# EAGLE design musicbox mechanical-02 (EAGLE 9.6.2)
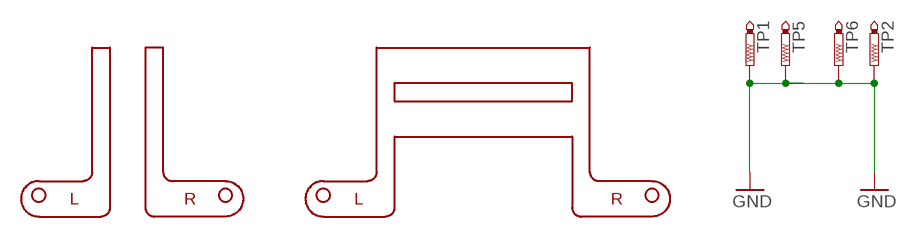
[diagram p0: schematic, sheet 1]

## Parts
TP1  PTR1B1,27  [B1,27]
TP2  PTR1B1,27  [B1,27]
TP5  PTR1B1,27  [B1,27]
TP6  PTR1B1,27  [B1,27]
U$1  LEFT-FOOT  [LEFT-FOOT]
U$3  RIGHT-FOOT  [RIGHT-FOOT]
U$5  TOP-PART  [TOP-PART]

## Nets
GND: TP1.TP TP2.TP TP5.TP TP6.TP

## Library data of the parts
TP1 TP2 TP5 TP6 = testpad:PTR1: TEST PIN
U$1 = music-box-parts:LEFT-FOOT
U$3 = music-box-parts:RIGHT-FOOT
U$5 = music-box-parts:TOP-PART

## Board
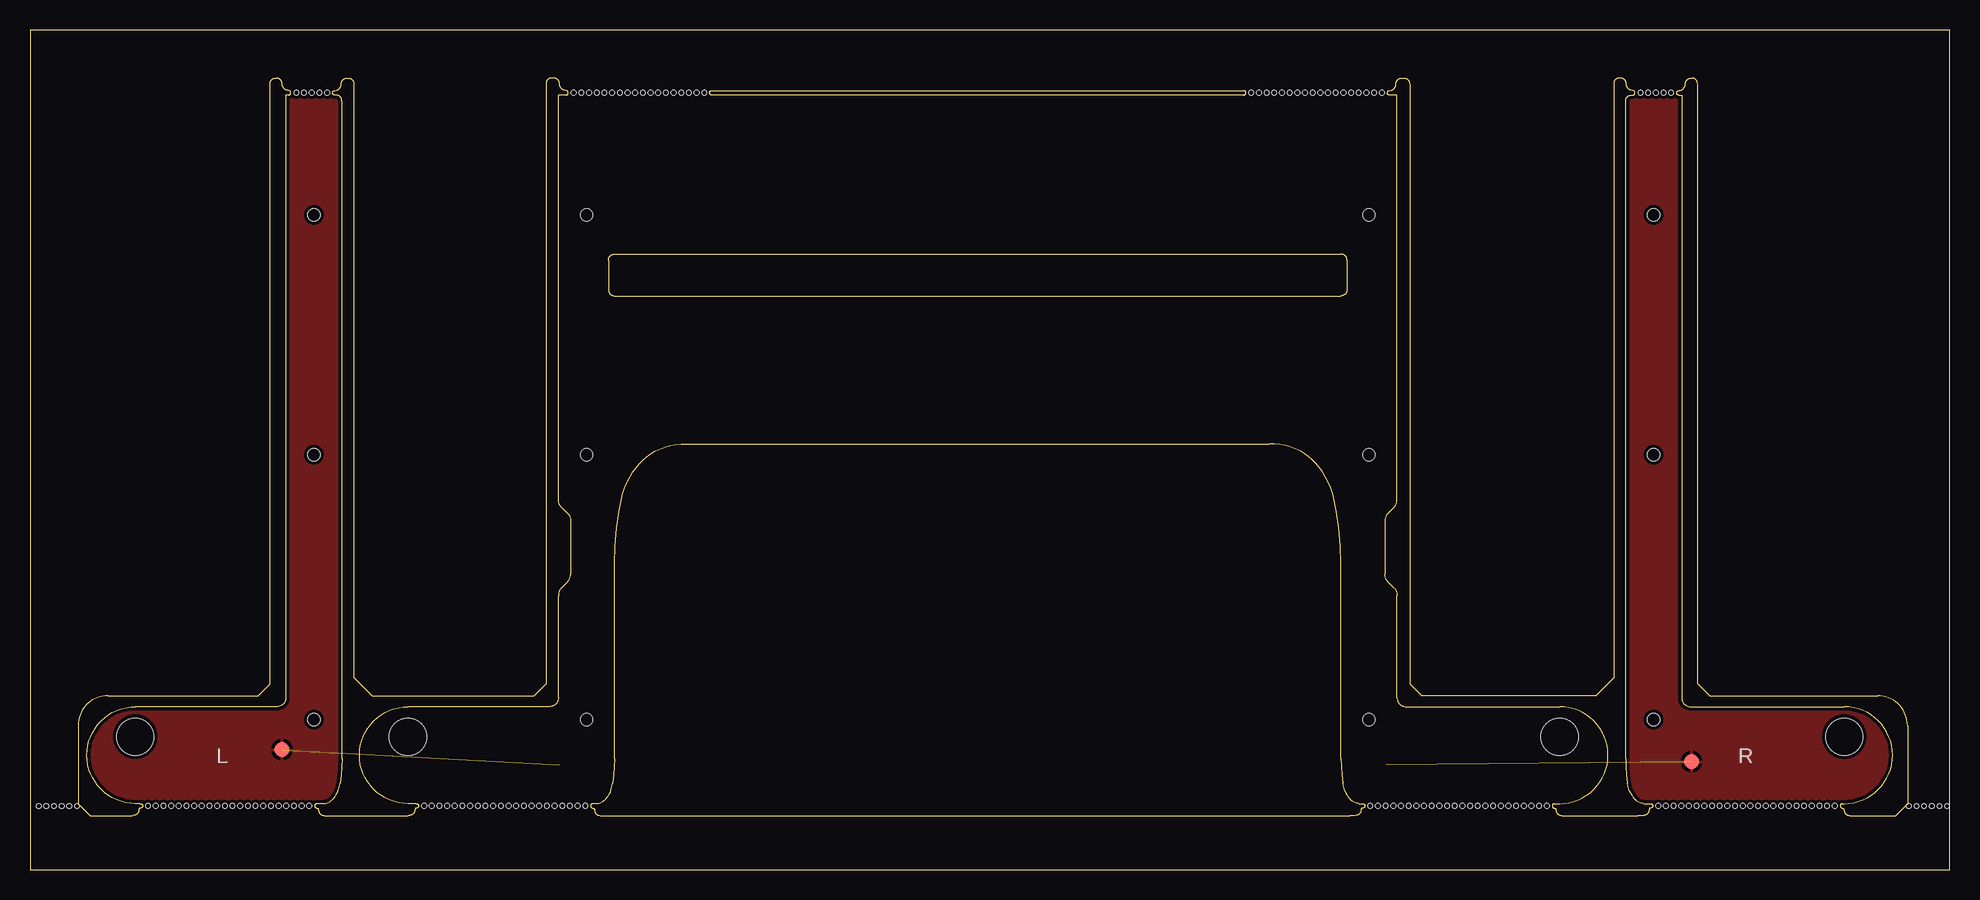
[diagram p1: board, top side]
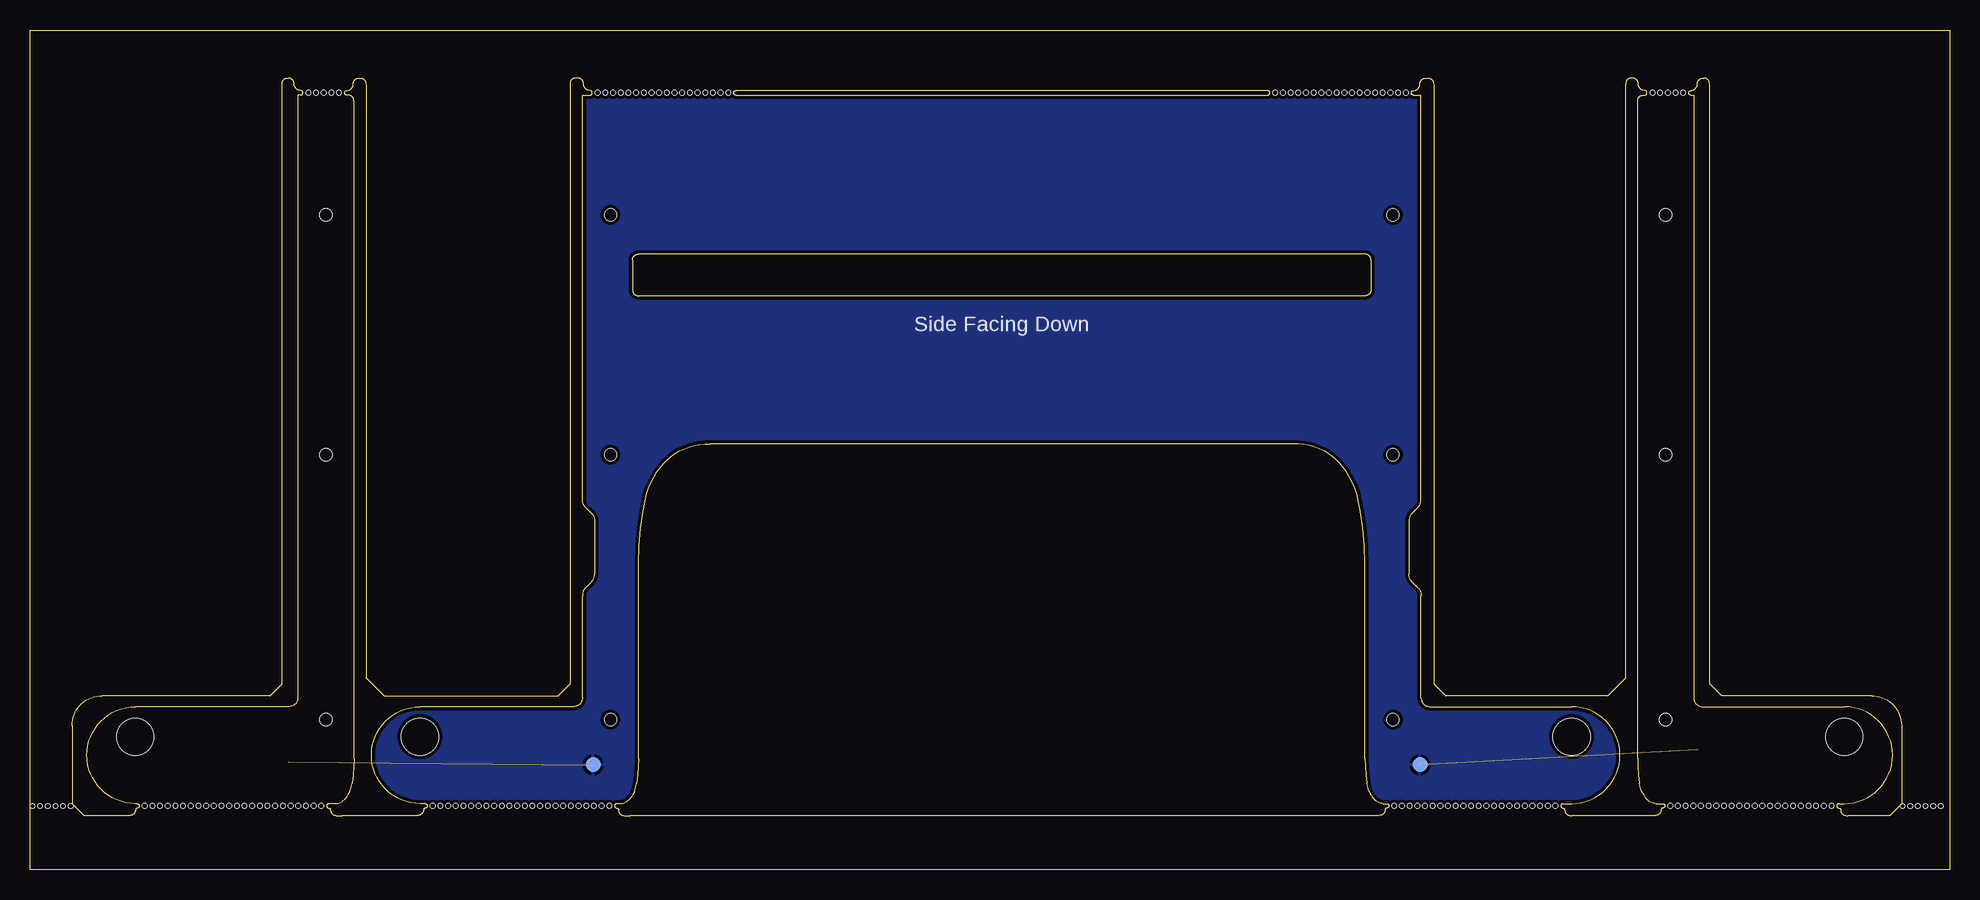
[diagram p2: board, bottom side, seen from below]

Size 160 x 70 mm. Coordinates in mm from the lower left corner, seen from the top.
Outline: 8.5,4.5 5,4.5 4,5.5 4,12 arc-90 6.5,14.5 17,14.5 19,14.5 20,15.5 20,17.5 20,65.5 arc-90 20.5,66
Outline: 132.5,66 arc90 132,65.5 132,16 130.5,14.5 116,14.5 115,15.5 115,65.5 arc90 114.5,66
Outline: 26.5,66 arc-90 27,65.5 27,16 28.5,14.5 42,14.5 43,15.5 43,65.5 arc-90 43.5,66
Outline: 48,4.5 110,4.5
Outline: 152,4.5 155.5,4.5 156.5,5.5 156.5,12 arc90 154,14.5 143,14.5 140,14.5 139,15.5 139,17.5 139,65.5 arc90 138.5,66
Outline: 128,4.5 134,4.5
Outline: 25,4.5 31.5,4.5
Outline: 0,0 160,0 160,70 0,70 0,0
Copper layers (1*16): Top 0.035mm / dielectric 1.5mm / Bottom 0.035mm
Design rules "default *": minimum track width 6mil, minimum drill 0.35mm, track to track 6mil, track to pad 6mil, pad to pad 6mil, via to via 6mil, smd to smd 6mil, copper to edge 12mil, drill to drill 6mil, minimum pad ring 10mil, minimum via ring 8mil, stop-mask expansion 4mil, vias tented up to drill 0mil, thermal gap 10mil
Holes 0.38 mm at 3.92,5.3 3.28,5.3 2.64,5.3 2,5.3 1.36,5.3 0.72,5.3 156.6,5.3 157.24,5.3 157.88,5.3 158.52,5.3 159.16,5.3 159.8,5.3

### Footprints (pad centres in the part's own frame; a part is rotated, then mirrored left to right if it is on the bottom)
B1,27 = smd 1.27 x 1.27: TP 0,0
LEFT-FOOT = hole 3.075: -17.225,5.575 | hole 1: -2.337,49.075; -2.337,29.075; -2.337,7 | hole 0.38: -1.24,59.265; -1.88,59.265; -2.52,59.265; -3.16,59.265; -3.8,59.265; -2.72,-0.19; -3.36,-0.19; -4,-0.19; -4.64,-0.19; -5.28,-0.19; -5.92,-0.19; -6.56,-0.19; -7.2,-0.19; -7.84,-0.19; -8.48,-0.19; -9.12,-0.19; -9.76,-0.19; -10.4,-0.19; -11.04,-0.19; -11.68,-0.19; -12.32,-0.19; -12.96,-0.19; -13.6,-0.19; -14.24,-0.19; -14.88,-0.19; -15.52,-0.19; -16.16,-0.19
RIGHT-FOOT = hole 3.075: 18.225,5.575 | hole 1: 2.337,7; 2.337,29.075; 2.337,49.075 | hole 0.38: 1.24,59.265; 1.88,59.265; 2.52,59.265; 3.16,59.265; 3.8,59.265; 2.72,-0.19; 3.36,-0.19; 4,-0.19; 4.64,-0.19; 5.28,-0.19; 5.92,-0.19; 6.56,-0.19; 7.2,-0.19; 7.84,-0.19; 8.48,-0.19; 9.12,-0.19; 9.76,-0.19; 10.4,-0.19; 11.04,-0.19; 11.68,-0.19; 12.32,-0.19; 12.96,-0.19; 13.6,-0.19; 14.24,-0.19; 14.88,-0.19; 15.52,-0.19; 16.16,-0.19; 16.8,-0.19; 17.44,-0.19
TOP-PART = hole 1: -32.612,29.075; -32.612,7; -32.612,49.075; 32.612,49.075; 32.612,29.075; 32.612,7 | hole 3.075: 48.5,5.575; -47.5,5.575 | hole 0.38: 32.715,-0.19; 33.355,-0.19; 33.995,-0.19; 34.635,-0.19; 35.275,-0.19; 35.915,-0.19; 36.555,-0.19; 37.195,-0.19; 37.835,-0.19; 38.475,-0.19; 39.115,-0.19; 39.755,-0.19; 40.395,-0.19; 41.035,-0.19; 41.675,-0.19; 42.315,-0.19; 42.955,-0.19; 43.595,-0.19; 44.235,-0.19; 44.875,-0.19; 45.515,-0.19; 46.155,-0.19; 46.795,-0.19; 47.435,-0.19; -32.715,-0.19; -33.355,-0.19; -33.995,-0.19; -34.635,-0.19; -35.275,-0.19; -35.915,-0.19; -36.555,-0.19; -37.195,-0.19; -37.835,-0.19; -38.475,-0.19; -39.115,-0.19; -39.755,-0.19; -40.395,-0.19; -41.035,-0.19; -41.675,-0.19; -42.315,-0.19; -42.955,-0.19; -43.595,-0.19; -44.235,-0.19; -44.875,-0.19; -45.515,-0.19; -46.155,-0.19; 33.678,59.265; 33.038,59.265; 32.398,59.265; 31.758,59.265; 31.118,59.265; 30.478,59.265; 29.838,59.265; 29.198,59.265; 28.558,59.265; 27.918,59.265; 27.278,59.265; 26.638,59.265; 25.998,59.265; 25.358,59.265; 24.718,59.265; 24.078,59.265; 23.438,59.265; 22.798,59.265; -33.678,59.265; -33.038,59.265; -32.398,59.265; -31.758,59.265; -31.118,59.265; -30.478,59.265; -29.838,59.265; -29.198,59.265; -28.558,59.265; -27.918,59.265; -27.278,59.265; -26.638,59.265; -25.998,59.265; -25.358,59.265; -24.718,59.265; -24.078,59.265; -23.438,59.265; -22.798,59.265

### Placement (x,y rotation side)
TP1  44.14,8.73 0 bottom
TP2  113.06,8.73 0 bottom
TP5  21,10 0 top
TP6  138.5,9 0 top
U$1  26,5.5 0 top
U$3  133,5.5 0 top
U$5  79,5.5 0 top

### Tracks (layer width: path | path; a pad name or v marks a point on that pad's centre or on a via)
GND  (2 unrouted)
  pour Top: -3,-1 161.5,-1 161.5,71.5 -3,71.5
  pour Bottom: -2.5,-1.5 162,-1.5 162,71 -2.5,71